# EAGLE design shield-v3 (EAGLE 8.6.0)
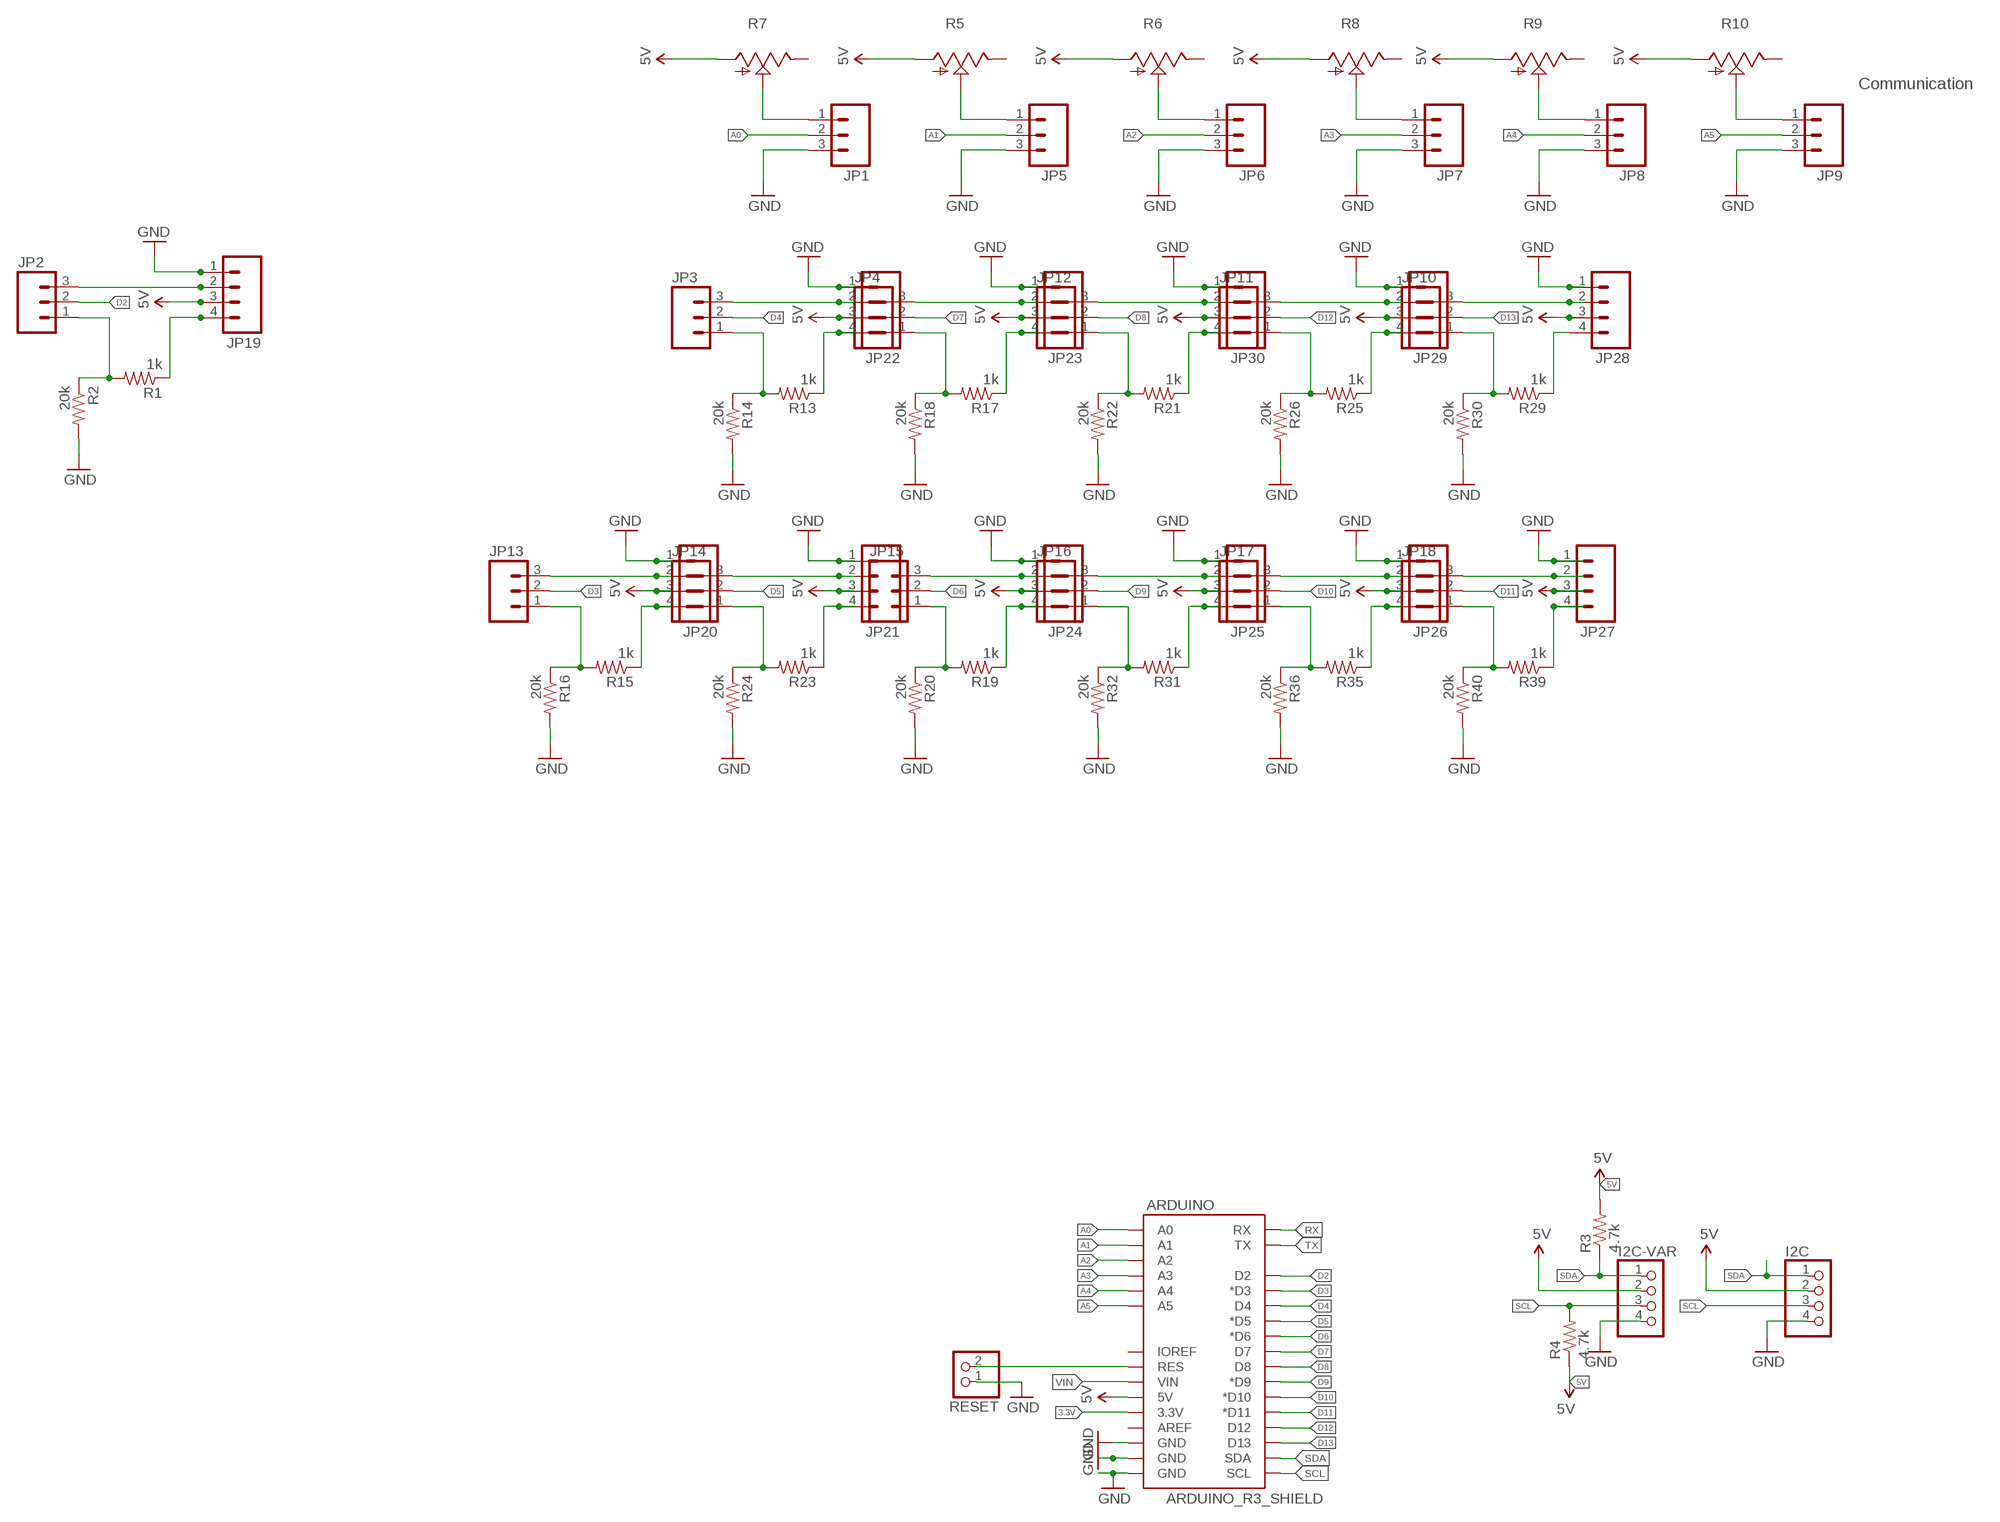
[diagram p0: schematic, sheet 1]

## Parts
ARDUINO  ARDUINO_R3_SHIELD  [UNO_R3_SHIELD]
I2C  PINHD-1X4  [1X04]
I2C-VAR  PINHD-1X4  [1X04]
JP1  M03LOCK_NO_SILK  [1X03_LOCK_NO_SILK]
JP2  M03LOCK_NO_SILK  [1X03_LOCK_NO_SILK]
JP3  M03LOCK_NO_SILK  [1X03_LOCK_NO_SILK]
JP4  M03LOCK_NO_SILK  [1X03_LOCK_NO_SILK]
JP5  M03LOCK_NO_SILK  [1X03_LOCK_NO_SILK]
JP6  M03LOCK_NO_SILK  [1X03_LOCK_NO_SILK]
JP7  M03LOCK_NO_SILK  [1X03_LOCK_NO_SILK]
JP8  M03LOCK_NO_SILK  [1X03_LOCK_NO_SILK]
JP9  M03LOCK_NO_SILK  [1X03_LOCK_NO_SILK]
JP10  M03LOCK_NO_SILK  [1X03_LOCK_NO_SILK]
JP11  M03LOCK_NO_SILK  [1X03_LOCK_NO_SILK]
JP12  M03LOCK_NO_SILK  [1X03_LOCK_NO_SILK]
JP13  M03LOCK_NO_SILK  [1X03_LOCK_NO_SILK]
JP14  M03LOCK_NO_SILK  [1X03_LOCK_NO_SILK]
JP15  M03LOCK_NO_SILK  [1X03_LOCK_NO_SILK]
JP16  M03LOCK_NO_SILK  [1X03_LOCK_NO_SILK]
JP17  M03LOCK_NO_SILK  [1X03_LOCK_NO_SILK]
JP18  M03LOCK_NO_SILK  [1X03_LOCK_NO_SILK]
JP19  M04LOCK  [1X04_LOCK]
JP20  M04LOCK  [1X04_LOCK]
JP21  M04LOCK  [1X04_LOCK]
JP22  M04LOCK  [1X04_LOCK]
JP23  M04LOCK  [1X04_LOCK]
JP24  M04LOCK  [1X04_LOCK]
JP25  M04LOCK  [1X04_LOCK]
JP26  M04LOCK  [1X04_LOCK]
JP27  M04LOCK  [1X04_LOCK]
JP28  M04LOCK  [1X04_LOCK]
JP29  M04LOCK  [1X04_LOCK]
JP30  M04LOCK  [1X04_LOCK]
R1  1k  RESISTORKIT  [AXIAL-0.3-KIT]
R2  20k  RESISTORKIT  [AXIAL-0.3-KIT]
R3  4.7k  RESISTORKIT  [AXIAL-0.3-KIT]
R4  4.7k  RESISTORKIT  [AXIAL-0.3-KIT]
R5  TRIM_US-CA6V  [CA6V]
R6  TRIM_US-CA6V  [CA6V]
R7  TRIM_US-CA6V  [CA6V]
R8  TRIM_US-CA6V  [CA6V]
R9  TRIM_US-CA6V  [CA6V]
R10  TRIM_US-CA6V  [CA6V]
R13  1k  RESISTORKIT  [AXIAL-0.3-KIT]
R14  20k  RESISTORKIT  [AXIAL-0.3-KIT]
R15  1k  RESISTORKIT  [AXIAL-0.3-KIT]
R16  20k  RESISTORKIT  [AXIAL-0.3-KIT]
R17  1k  RESISTORKIT  [AXIAL-0.3-KIT]
R18  20k  RESISTORKIT  [AXIAL-0.3-KIT]
R19  1k  RESISTORKIT  [AXIAL-0.3-KIT]
R20  20k  RESISTORKIT  [AXIAL-0.3-KIT]
R21  1k  RESISTORKIT  [AXIAL-0.3-KIT]
R22  20k  RESISTORKIT  [AXIAL-0.3-KIT]
R23  1k  RESISTORKIT  [AXIAL-0.3-KIT]
R24  20k  RESISTORKIT  [AXIAL-0.3-KIT]
R25  1k  RESISTORKIT  [AXIAL-0.3-KIT]
R26  20k  RESISTORKIT  [AXIAL-0.3-KIT]
R29  1k  RESISTORKIT  [AXIAL-0.3-KIT]
R30  20k  RESISTORKIT  [AXIAL-0.3-KIT]
R31  1k  RESISTORKIT  [AXIAL-0.3-KIT]
R32  20k  RESISTORKIT  [AXIAL-0.3-KIT]
R35  1k  RESISTORKIT  [AXIAL-0.3-KIT]
R36  20k  RESISTORKIT  [AXIAL-0.3-KIT]
R39  1k  RESISTORKIT  [AXIAL-0.3-KIT]
R40  20k  RESISTORKIT  [AXIAL-0.3-KIT]
RESET  PINHD-1X2  [1X02]

## Nets
3.3V: ARDUINO.3.3V
5V: ARDUINO.5V I2C-VAR.2 I2C.2 JP19.3 JP20.3 JP21.3 JP22.3 JP23.3 JP24.3 JP25.3 JP26.3 JP27.3 JP28.3 JP29.3 JP30.3 R3.P$2 R4.P$1 R5.A R6.A R7.A R8.A R9.A R10.A
A0: ARDUINO.A0 JP1.2
A1: ARDUINO.A1 JP5.2
A2: ARDUINO.A2 JP6.2
A3: ARDUINO.A3 JP7.2
A4: ARDUINO.A4 JP8.2
A5: ARDUINO.A5 JP9.2
D2: ARDUINO.D2 JP2.2
D3: ARDUINO.D3(*D3) JP13.2
D4: ARDUINO.D4 JP3.2
D5: ARDUINO.D5(*D5) JP14.2
D6: ARDUINO.D6(*D6) JP15.2
D7: ARDUINO.D7 JP4.2
D8: ARDUINO.D8 JP12.2
D9: ARDUINO.D9(*D9) JP16.2
D10: ARDUINO.D10(*D10) JP17.2
D11: ARDUINO.D11(*D11) JP18.2
D12: ARDUINO.D12 JP11.2
D13: ARDUINO.D13 JP10.2
GND: ARDUINO.GND@0(GND) ARDUINO.GND@1(GND) ARDUINO.GND@2(GND) I2C-VAR.4 I2C.4 JP1.3 JP5.3 JP6.3 JP7.3 JP8.3 JP9.3 JP19.1 JP20.1 JP21.1 JP22.1 JP23.1 JP24.1 JP25.1 JP26.1 JP27.1 JP28.1 JP29.1 JP30.1 R2.P$2 R14.P$2 R16.P$2 R18.P$2 R20.P$2 R22.P$2 R24.P$2 R26.P$2 R30.P$2 R32.P$2 R36.P$2 R40.P$2 RESET.1
N$1: ARDUINO.RES RESET.2
N$2: JP1.1 R7.S
N$3: JP5.1 R5.S
N$4: JP6.1 R6.S
N$5: JP7.1 R8.S
N$6: JP8.1 R9.S
N$7: JP9.1 R10.S
N$11: JP19.4 R1.P$1
N$12: JP2.3 JP19.2
N$13: JP2.1 R1.P$2 R2.P$1
N$14: JP22.4 R13.P$1
N$15: JP3.3 JP22.2
N$16: JP3.1 R13.P$2 R14.P$1
N$17: JP20.4 R15.P$1
N$18: JP13.3 JP20.2
N$19: JP13.1 R15.P$2 R16.P$1
N$20: JP23.4 R17.P$1
N$23: JP4.3 JP23.2
N$24: JP4.1 R17.P$2 R18.P$1
N$25: JP24.4 R19.P$1
N$26: JP15.3 JP24.2
N$27: JP15.1 R19.P$2 R20.P$1
N$28: JP30.4 R21.P$1
N$29: JP12.3 JP30.2
N$30: JP12.1 R21.P$2 R22.P$1
N$31: JP21.4 R23.P$1
N$32: JP14.3 JP21.2
N$33: JP14.1 R23.P$2 R24.P$1
N$34: JP29.4 R25.P$1
N$35: JP11.3 JP29.2
N$36: JP11.1 R25.P$2 R26.P$1
N$40: JP28.4 R29.P$1
N$41: JP10.3 JP28.2
N$42: JP10.1 R29.P$2 R30.P$1
N$43: JP25.4 R31.P$1
N$44: JP16.3 JP25.2
N$45: JP16.1 R31.P$2 R32.P$1
N$49: JP26.4 R35.P$1
N$50: JP17.3 JP26.2
N$51: JP17.1 R35.P$2 R36.P$1
N$55: JP27.4 R39.P$1
N$56: JP18.3 JP27.2
N$57: JP18.1 R39.P$2 R40.P$1
RX: ARDUINO.RX
SCL: ARDUINO.SCL I2C-VAR.3 I2C.3 R4.P$2
SDA: ARDUINO.SDA I2C-VAR.1 I2C.1 R3.P$1
TX: ARDUINO.TX
VIN: ARDUINO.VIN
Unconnected: ARDUINO.AREF ARDUINO.IOREF R5.E R6.E R7.E R8.E R9.E R10.E

## Notes on the sheet
- Communication

## Library data of the parts
ARDUINO = Nathans-Arduinos:ARDUINO_R3_SHIELD: Shield form compatible with the Arduino Uno R3.
I2C I2C-VAR = pinhead:PINHD-1X4: PIN HEADER
JP1-JP18 = SparkFun-Connectors:M03: Header 3 Standard 3-pin 0.1" header. Use with straight break away headers (SKU : PRT-00116), right angle break away headers (PRT-00553), swiss pins (PRT-00743), machine pins (PRT-00117), and female headers (PRT-00115). Molex polarized connector foot print use with SKU : PRT-08232 with associated crimp pins and housings.
JP19-JP30 = SparkFun-Connectors:M04: Header 4 Standard 4-pin 0.1" header. Use with straight break away headers (SKU : PRT-00116), right angle break away headers (PRT-00553), swiss pins (PRT-00743), machine pins (PRT-00117), and female headers (PRT-00115). Molex polarized connector foot print use with SKU : PRT-08231 with associated crimp pins and housings. 1MM SMD Version SKU: PRT-10208
R1-R4 R13-R26 R29-R32 R35 R36 R39 R40 = SparkFun-Resistors:RESISTOR: Resistor Basic schematic elements and footprints for 0603, 1206, and PTH resistors.
R5-R10 = pot:TRIM_US-: POTENTIOMETER
RESET = pinhead:PINHD-1X2: PIN HEADER

## Net classes
0 default: width 0.305 mm, drill 0.406 mm, clearance 0.229 mm

## Board
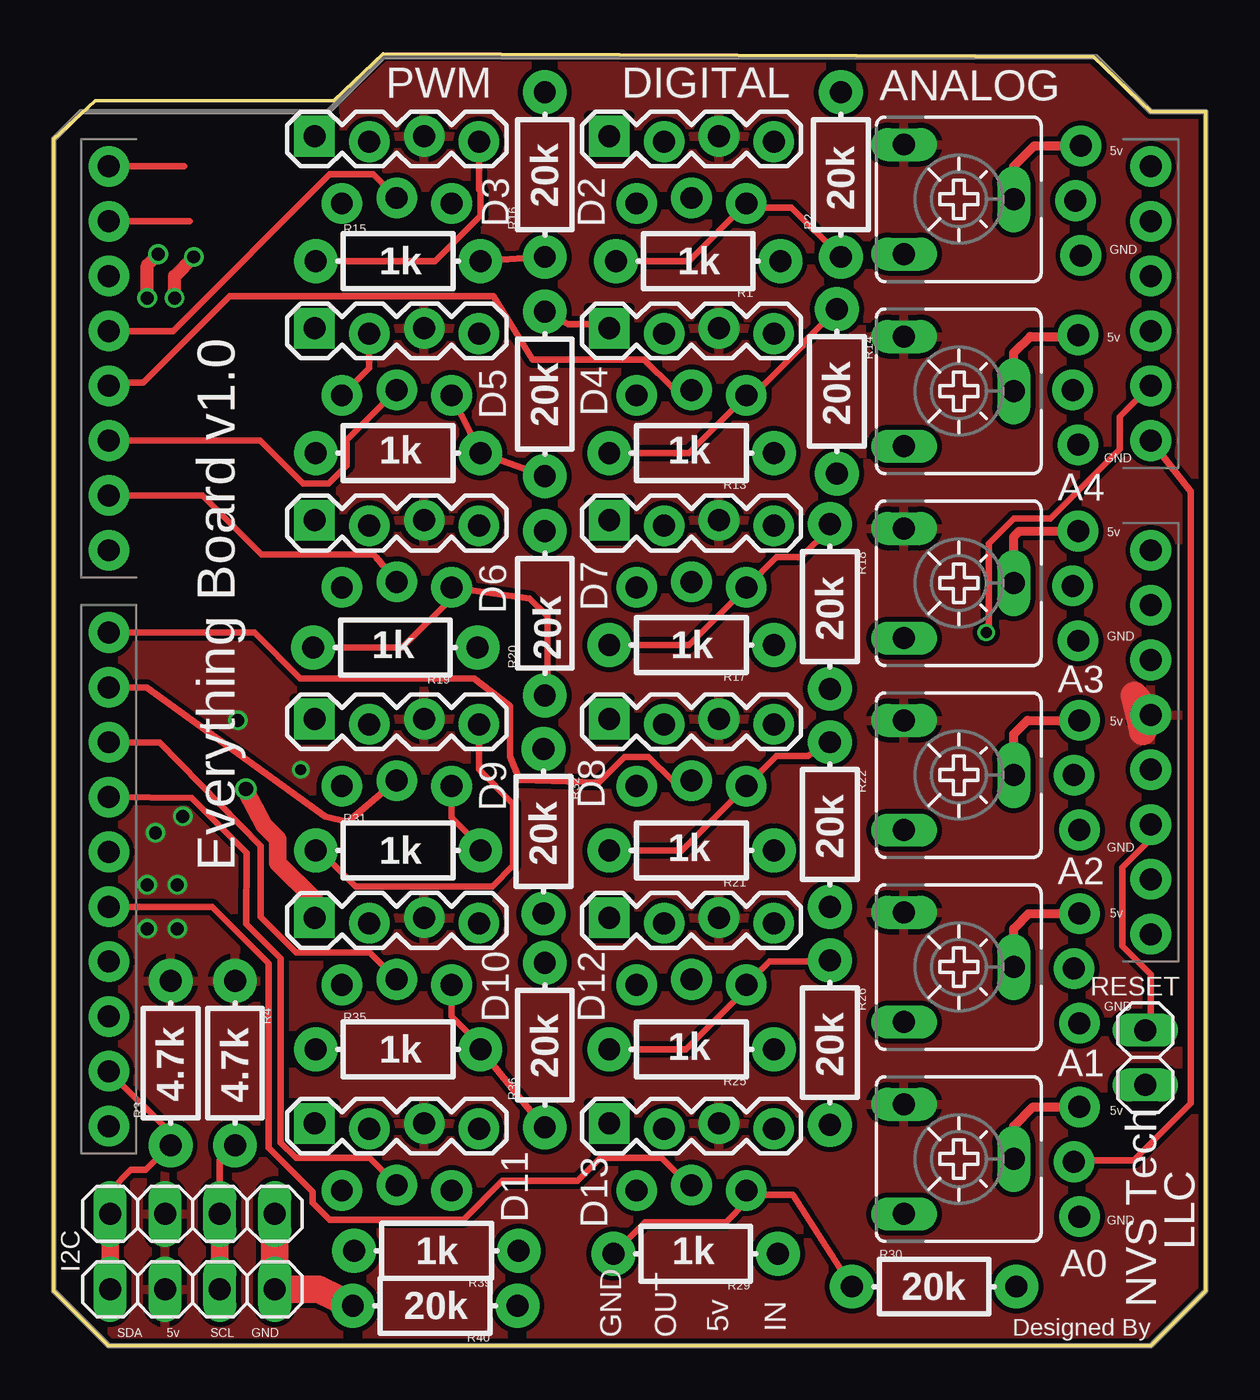
[diagram p1: board, top side]
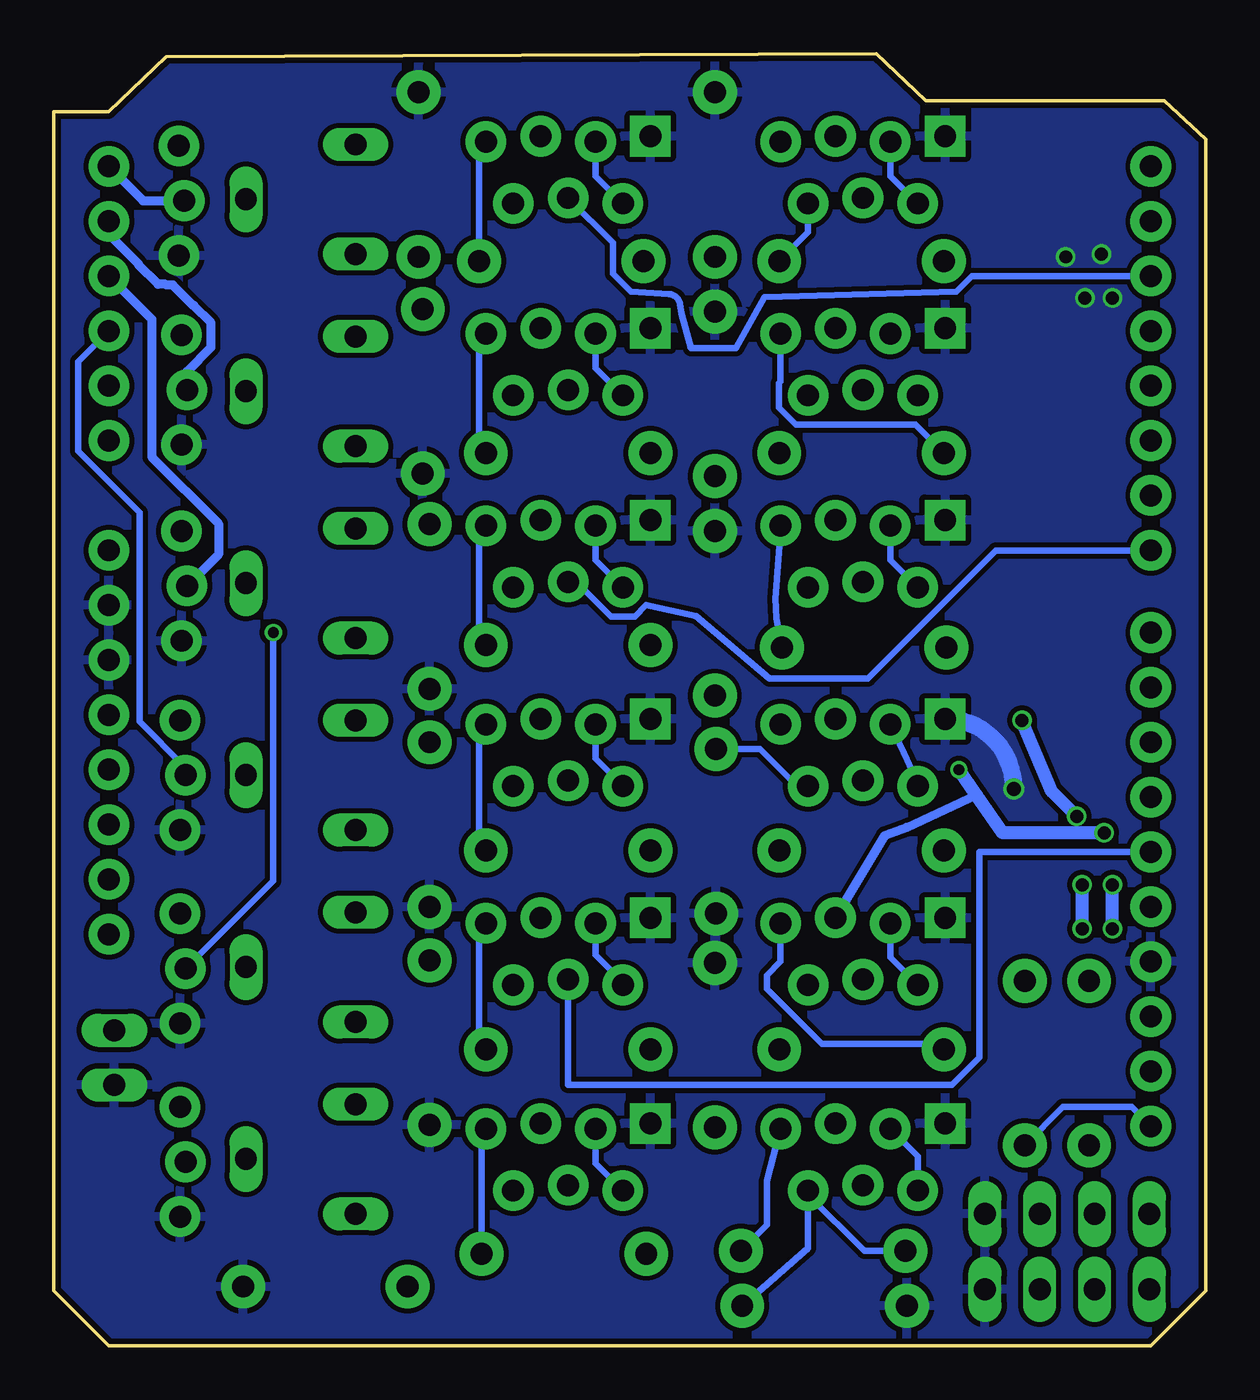
[diagram p2: board, bottom side, seen from below]

Size 53.34 x 59.82 mm. Coordinates in mm from the lower left corner, seen from the top.
Outline: 0,55.88 1.91,57.66 12.95,57.66 15.24,59.82 48.13,59.69 50.8,57.15 53.34,57.15 53.34,2.54 50.8,0 2.54,0 0,2.54 0,55.88
Copper layers (1*16): Top 0.035mm / dielectric 1.5mm / Bottom 0.035mm
Design rules "SeeedStudio_2layer_DRU_no_angle_20140221": minimum track width 6mil, minimum drill 12mil, track to track 6mil, track to pad 6mil, pad to pad 6mil, via to via 6mil, smd to smd 0mil, copper to edge 10mil, drill to drill 10mil, minimum pad ring 10mil, minimum via ring 6mil, stop-mask expansion 2mil, vias tented up to drill 100mil, thermal gap 10mil

### Footprints (pad centres in the part's own frame; a part is rotated, then mirrored left to right if it is on the bottom)
UNO_R3_SHIELD = drill 1.016 pad 1.88: 3.3V 50.8,26.67; 5V 50.8,29.21; A0 50.8,41.91; A1 50.8,44.45; A2 50.8,46.99; A3 50.8,49.53; A4 50.8,52.07; A5 50.8,54.61; AREF 2.54,15.24; D2 2.54,49.53; D3 2.54,46.99; D4 2.54,44.45; D5 2.54,41.91; D6 2.54,39.37; D7 2.54,36.83; D8 2.54,33.02; D9 2.54,30.48; D10 2.54,27.94; D11 2.54,25.4; D12 2.54,22.86; D13 2.54,20.32; GND@0 50.8,31.75; GND@1 50.8,34.29; GND@2 2.54,17.78; IOREF 50.8,21.59; NC 50.8,19.05; RES 50.8,24.13; RX 2.54,54.61; SCL 2.54,10.16; SDA 2.54,12.7; TX 2.54,52.07; VIN 50.8,36.83
1X04 = drill 1.016 long: 1 -3.81,0; 2 -1.27,0; 3 1.27,0; 4 3.81,0
1X03_LOCK_NO_SILK = drill 1.016 pad 1.88: 1 0,0.127; 2 2.54,-0.127; 3 5.08,0.127
1X04_LOCK = drill 1.016 pad 1.88 square: 1 0,0.127 | drill 1.016 pad 1.88: 2 2.54,-0.127; 3 5.08,0.127; 4 7.62,-0.127
AXIAL-0.3-KIT = drill 1.016 pad 2.032: P$1 -3.81,0; P$2 3.81,0
CA6V = drill 1.016 long: A -2.54,-2.54; E 2.54,-2.54; S 0,2.54
1X02 = drill 1.016 long: 1 -1.27,0; 2 1.27,0

### Placement (x,y rotation side)
ARDUINO  0,0 0 top
I2C  6.41,6.1 0 top
I2C-VAR  6.41,2.6 0 top
JP1  47.37,11.05 270 top
JP2  32.07,53.02 180 top
JP3  32.07,44.13 180 top
JP4  32.07,35.24 180 top
JP5  47.37,20 270 top
JP6  47.37,28.96 270 top
JP7  47.31,37.72 270 top
JP8  47.31,46.8 270 top
JP9  47.43,55.56 270 top
JP10  32.07,7.3 180 top
JP11  32.07,16.83 180 top
JP12  32.07,26.04 180 top
JP13  18.41,53.02 180 top
JP14  18.41,44.13 180 top
JP15  18.41,35.24 180 top
JP16  18.41,26.04 180 top
JP17  18.41,16.83 180 top
JP18  18.41,7.3 180 top
JP19  25.72,55.88 0 top
JP20  12.07,55.88 0 top
JP21  12.07,46.99 0 top
JP22  25.72,46.99 0 top
JP23  25.72,38.1 0 top
JP24  12.07,38.1 0 top
JP25  12.07,28.89 0 top
JP26  12.07,19.68 0 top
JP27  12.07,10.16 0 top
JP28  25.72,10.16 0 top
JP29  25.72,19.68 0 top
JP30  25.72,28.89 0 top
R1  29.84,50.23 180 top
R2  36.45,54.23 90 top
R3  5.4,13.08 90 top
R4  8.38,13.08 270 top
R5  41.91,17.53 270 top
R6  41.91,26.42 270 top
R7  41.91,8.64 270 top
R8  41.91,35.31 270 top
R9  41.91,44.2 270 top
R10  41.91,53.09 270 top
R13  29.53,41.34 180 top
R14  36.26,44.2 270 top
R15  15.94,50.23 0 top
R16  22.73,54.23 90 top
R17  29.53,32.45 180 top
R18  35.94,34.23 270 top
R19  15.81,32.32 180 top
R20  22.73,33.91 90 top
R21  29.53,22.92 180 top
R22  35.94,24.13 270 top
R23  15.94,41.34 0 top
R24  22.73,44.07 90 top
R25  29.53,13.72 180 top
R26  35.94,14.03 270 top
R29  29.72,4.25 180 top
R30  40.77,2.73 0 top
R31  15.94,22.92 0 top
R32  22.67,23.81 270 top
R35  15.94,13.72 0 top
R36  22.73,13.91 90 top
R39  17.72,4.38 180 top
R40  17.65,1.84 180 top
RESET  50.55,13.34 90 top

### Tracks (layer width: path | path; a pad name or v marks a point on that pad's centre or on a via)
5V  (via drill 0.5, 0.6)
  Top 1.27: ARDUINO.5V 50.04,30.1 50.42,28.45
  Bottom 0.406: JP26.3 14.86,23.62 13.84,24 10.61,25.49
  Bottom 0.61: v5.97,24.51 7.11,25.65 v8.51,28.96 | v4.7,23.75 9.4,23.75 10.61,25.49 v11.43,26.67 | v4.32,19.3 v4.32,21.34 | v5.72,19.3 v5.72,21.34
  pour Top: 15.56,59.82 48.13,59.69 50.8,57.15 53.34,57.15 53.34,2.54 50.8,0 2.54,0 0,2.54 0,55.88 2.16,57.66 13.08,57.66
A0
  Top 0.305: ARDUINO.A0 52.64,39.56 52.64,11.21 50.01,8.57 47.31,8.57 JP1.2
A1  (via drill 0.5)
  Top 0.305: 47.31,17.94 47.31,17.46 JP5.2 | ARDUINO.A1 49.37,43.02 49.37,41.52 46.15,38.3 44.46,38.3 43.31,37.15 43.31,33.27 arc90 43.18,33.15 v43.18,33.02
  Bottom 0.305: v43.18,33.02 43.18,21.53 JP5.2
A2
  Bottom 0.305: ARDUINO.A2 52.23,45.56 52.23,41.43 49.37,38.58 49.37,28.89 47.31,26.83 47.31,26.51 JP6.2
A3
  Bottom 0.406: ARDUINO.A3 48.81,47.54 48.81,41.15 45.72,38.06 45.72,36.64 JP7.2
A4
  Bottom 0.406: JP8.2 47.18,45.11 46.06,46.23 46.06,47.37 46.87,48.17 46.9,48.17 47.84,49.11 48.13,49.11 48.17,49.15 48.51,49.15 49.43,50.06 49.43,50.1 50.8,51.47 ARDUINO.A4
A5
  Bottom 0.406: ARDUINO.A5 49.21,53.02 JP9.2
D2
  Bottom 0.305: ARDUINO.D2 10.82,49.53 11.54,48.81 20.43,48.55 21.76,46.2 23.83,46.2 24.28,47.8 24.35,48.23 arc-79 24.86,48.7 26.62,48.81 27.46,49.64 27.46,51.08 JP2.2
D3
  Top 0.305: ARDUINO.D3 5.53,46.99 12.78,54.24 14.78,54.24 JP13.2
D4
  Top 0.305: JP3.2 29.46,44.34 28.66,44.34 27.33,45.67 22.16,45.67 20.37,48.6 8.13,48.6 4.13,44.6 2.79,44.6 ARDUINO.D4
D5
  Top 0.305: ARDUINO.D5 9.55,41.91 11.54,39.92 12.72,39.92 13.55,40.75 13.55,41.93 JP14.2
D6
  Top 0.305: ARDUINO.D6 6.88,39.37 9.62,36.63 14.81,36.63 14.92,36.51 JP15.2
D7
  Bottom 0.305: ARDUINO.D7 9.72,36.83 15.65,30.9 20.21,30.9 23.6,33.78 25.91,34.29 26.43,33.77 27.55,33.77 29.14,35.37 JP4.2
D8
  Top 0.305: ARDUINO.D8 9.29,33.02 11.41,30.9 19.46,30.9 21.12,29.62 21.12,27.29 21.57,26.2 25.25,26.07 26.43,27.25 27.55,27.25 28.64,26.16 JP12.2
D9
  Top 0.305: JP16.2 13.6,24.24 12.56,24.5 4.29,30.48 ARDUINO.D9
D10
  Top 0.305: JP17.2 14.62,18.21 11.21,18.21 9.58,19.85 9.58,23.13 4.89,27.94 ARDUINO.D10
D11
  Top 0.305: JP18.2 14.62,8.69 11.21,8.69 10.5,9.39 10.5,17.93 8.91,19.52 8.93,22.82 6.39,25.36 ARDUINO.D11
D12
  Bottom 0.305: ARDUINO.D12 10.48,22.86 10.48,13.34 11.75,12.07 29.53,12.07 JP11.2
D13
  Top 0.305: ARDUINO.D13 7.32,20.32 9.94,17.69 9.94,9.16 11.99,7.12 11.99,6.62 12.78,5.83 18.97,5.83 20.76,7.62 24.26,7.62 25.32,8.69 28.14,8.69 29.4,7.43 JP10.2
GND  (via drill 0.6, 0.65)
  Top 0.305: R24.P$2 23.81,47.31 25.72,47.31 JP22.1
  Top 0.61: v4.32,48.51 4.32,50.04 v4.83,50.55 | v5.59,48.51 5.59,49.53 v6.48,50.42
  Top 0.813: JP26.1 12.07,20.65 10.37,22.35 10.37,23.47 9.74,24.1 8.89,25.65 v8.89,25.78
  Top 1.27: R40.P$2 12.26,2.6 I2C-VAR.4 I2C.4
  Bottom 0.813: v8.89,25.78 8.89,25.84 arc-90 JP25.1
  pour Bottom: 15.56,59.82 12.95,57.66 2.16,57.66 0,55.88 0,2.54 2.54,0 50.8,0 53.34,2.54 53.34,57.15 50.8,57.15 48.13,59.69
N$1
  Top 0.305: 51.12,14.61 50.8,14.61 | 50.8,14.61 RESET.2 | ARDUINO.RES 50.8,23.46 49.48,22.14 49.48,18.5 50.8,17.18 50.8,14.61
N$2
  Top 0.406: R7.S 44.45,10.16 45.34,11.05 JP1.1
N$3
  Top 0.406: R5.S 44.45,19.3 45.15,20 JP5.1
N$4
  Top 0.406: R6.S 44.45,28.32 45.09,28.96 JP6.1
N$5
  Top 0.406: R8.S 44.45,37.46 44.7,37.72 JP7.1
N$6
  Top 0.406: 44.45,45.72 R9.S 44.45,45.97 45.21,46.74 47.37,46.74 JP8.1
N$7
  Top 0.406: R10.S 44.45,54.61 45.4,55.56 JP9.1
N$11
  Bottom 0.305: R1.P$1 33.66,55.24 33.34,55.56 JP19.4
N$12
  Bottom 0.305: JP2.3 28.26,54.16 JP19.2
N$13
  Top 0.305: R1.P$2 29.4,50.23 JP2.1 32.26,52.7 34.16,52.7 R2.P$1
N$14
  Bottom 0.305: R13.P$1 33.66,41.66 33.66,46.55 JP22.4
N$15
  Bottom 0.305: JP3.3 28.26,45.27 JP22.2
N$16
  Top 0.305: R13.P$2 29.4,41.34 JP3.1 32.38,44.01 34.68,46.3 34.68,46.43 R14.P$1
N$17
  Top 0.305: JP20.4 19.69,53.53 19.76,53.45 19.76,52.34 17.65,50.23 R15.P$1
N$18
  Bottom 0.305: JP13.3 14.61,54.16 JP20.2
N$19
  Top 0.305: R15.P$2 R16.P$1
  Bottom 0.305: JP13.1 18.41,51.56 R15.P$2
N$20
  Bottom 0.305: R17.P$1 33.34,32.7 33.66,33.02 33.66,37.65 JP23.4
N$23
  Bottom 0.305: JP4.3 28.26,36.39 JP23.2
N$24
  Top 0.305: R17.P$2 29.4,32.45 JP4.1 33.47,36.51 34.61,36.51 35.94,37.85 R18.P$1
N$25
  Bottom 0.305: R19.P$1 19.88,33.67 19.91,34.6 19.66,37.95 JP24.4
N$26
  Bottom 0.305: JP15.3 14.61,36.39 JP24.2
N$27
  Top 0.305: R19.P$2 16.13,32.32 18.41,34.61 JP15.1 22.04,34.61 22.86,33.78 22.86,31.18 R20.P$1
N$28
  Bottom 0.305: R21.P$1 33.34,23.5 33.66,23.81 33.66,28.45 JP30.4
N$29
  Bottom 0.305: JP12.3 28.26,27.18 JP30.2
N$30
  Top 0.305: R21.P$2 29.08,22.92 JP12.1 33.47,27.3 34.93,27.3 R22.P$1
N$31
  Bottom 0.305: R23.P$1 13.45,42.66 18.97,42.66 19.76,43.45 19.76,44.56 19.69,44.64 JP21.4
N$32
  Top 0.305: JP14.3 14.61,45.27 JP21.2
  Bottom 0.305: JP14.3 13.53,44.01
N$33
  Top 0.305: JP14.1 R23.P$2 R24.P$1
N$34
  Bottom 0.305: R25.P$1 33.34,14.29 33.66,14.61 33.66,19.24 JP29.4
N$35
  Bottom 0.305: JP11.3 26.99,16.83 28.26,18.1 JP29.2
N$36
  Top 0.305: R25.P$2 29.27,13.72 32.07,16.51 JP11.1 33.15,17.78 35.88,17.78 R26.P$1
N$40
  Bottom 0.305: R29.P$1 33.53,9.84 JP28.4
N$41
  Bottom 0.305: JP10.3 28.26,8.45 JP28.2
N$42
  Top 0.305: R29.P$2 27.37,5.71 31.12,5.71 32.07,6.67 JP10.1 32.26,6.99 34.23,6.99 R30.P$1
N$43
  Top 0.305: JP25.4 19.69,26.67 21.27,25.08 21.27,22.23 20.32,21.27 13.97,21.27 12.38,22.86 R31.P$1
N$44
  Bottom 0.305: JP16.3 13.34,26.04 13.97,27.43 JP25.2
N$45
  Top 0.305: JP16.1 18.41,24.45 19.69,23.18 R31.P$2
  Bottom 0.305: R32.P$1 20.64,27.62 19.05,26.04 18.41,26.04 JP16.1
N$49
  Bottom 0.305: JP26.4 19.69,17.78 20.32,17.14 20.32,16.51 17.78,13.97 12.7,13.97 R35.P$1
N$50
  Bottom 0.305: JP17.3 14.61,17.97 JP26.2
N$51
  Top 0.305: R36.P$1 21.91,11.05 R35.P$2 19.69,13.97 18.41,15.24 JP17.1
N$55
  Bottom 0.305: R39.P$1 20.32,5.59 20.32,7.62 JP27.4
N$56
  Bottom 0.305: JP27.2 13.34,8.76 JP18.3
N$57
  Bottom 0.305: R39.P$2 15.81,4.38 18.41,6.99 | 18.41,6.99 JP18.1 | R40.P$1 18.41,4.51 18.41,6.99
RX
  Top 0.305: ARDUINO.RX 6.03,54.61
  Top 0.406: ARDUINO.RX 2.67,54.74
SCL
  Top 0.305: R4.P$2 7.68,8.57 I2C.3
  Top 0.813: I2C.3 I2C-VAR.3
  Bottom 0.305: ARDUINO.SCL 3.43,11.05 6.6,11.05 R4.P$2
SDA
  Top 0.305: ARDUINO.SDA 5.4,9.84 R3.P$1 4.25,8.13 3.56,8.13 2.6,7.18 I2C.1
  Top 0.813: I2C.1 I2C-VAR.1
TX
  Top 0.305: ARDUINO.TX 6.29,52.07

### Text on the board
tNames: PWM | DIGITAL | ANALOG | 5v | D3 | D2 | GND | 5v | D5 | D4 | GND | A4 | 5v | A5 | D6 | D7 | GND | A3 | 5v | D9 | D8 | GND | Everything Board v1.0 | A2 | 5v | GND | D10 | D12 | A1 | 5v | D11 | D13 | GND | LLC | A0 | Designed By | NVS Tech | SDA | 5v | SCL | GND | GND | OUT | 5v | IN